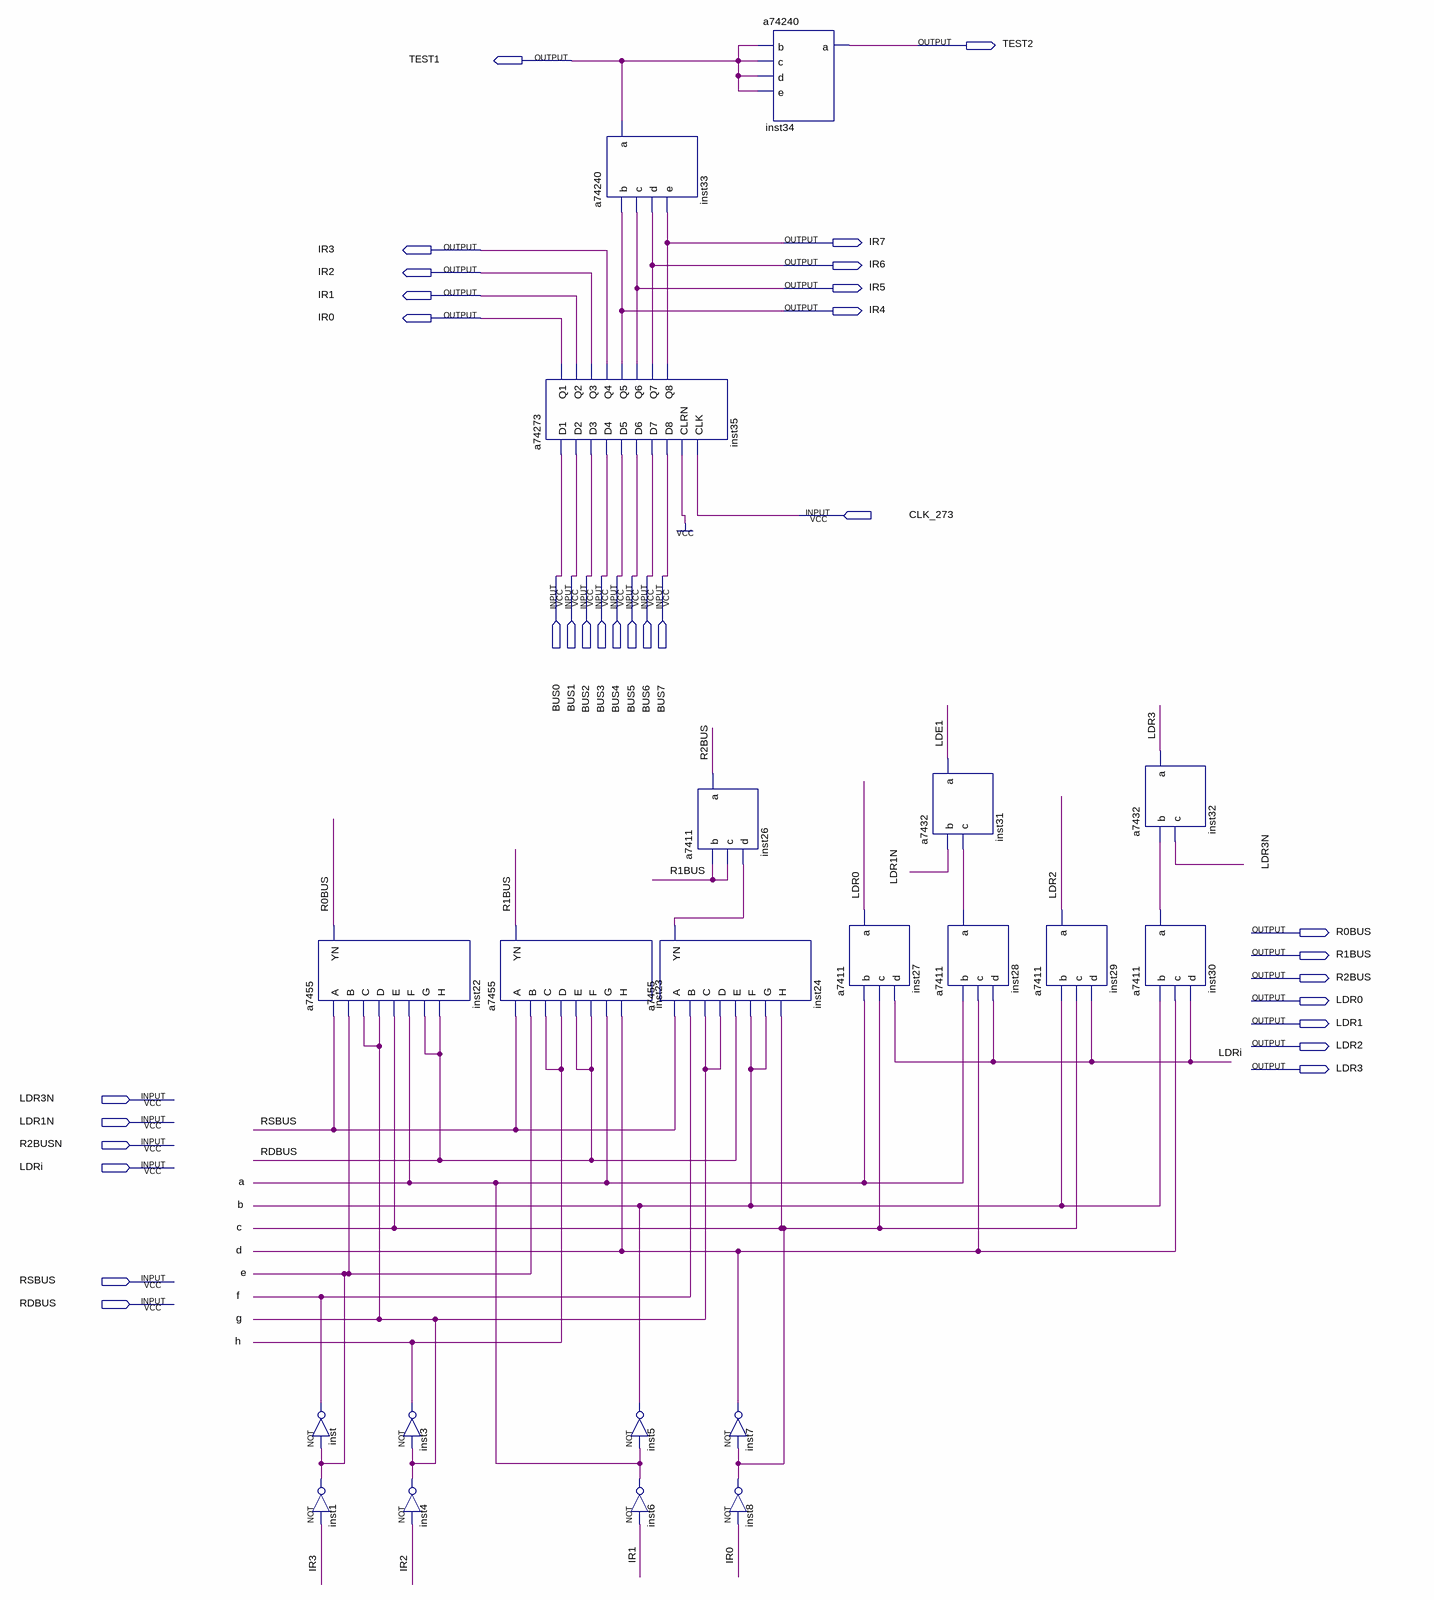
[diagram p0: schematic sheet]
// Quartus schematic EXEX.bdf as structural Verilog: 21 symbols, 32 pins
module EXEX (
  input  CLK_273,
  input  BUS0,
  input  BUS1,
  input  BUS2,
  input  BUS3,
  input  BUS4,
  input  BUS5,
  input  BUS6,
  input  BUS7,
  input  LDR3N,
  input  LDR1N,
  input  R2BUSN,
  input  LDRi,
  input  RSBUS,
  input  RDBUS,
  output TEST2,
  output TEST1,
  output IR7,
  output IR3,
  output IR6,
  output IR2,
  output IR5,
  output IR1,
  output IR4,
  output IR0,
  output R0BUS,
  output R1BUS,
  output R2BUS,
  output LDR0,
  output LDR1,
  output LDR2,
  output LDR3
);

  wire a, b, c, d, e, f, g, h, inst24_yn, inst28_a, inst30_a, LDE1;

  a7455 inst22 (.A(RSBUS), .B(e), .C(g), .D(g), .E(c), .F(a), .G(RDBUS), .H(RDBUS), .YN(R0BUS));
  not inst (f, e);
  not inst1 (e, IR3);
  not inst3 (h, g);
  not inst4 (g, IR2);
  a7455 inst23 (.A(RSBUS), .B(e), .C(h), .D(h), .E(RDBUS), .F(RDBUS), .G(a), .H(d), .YN(R1BUS));
  a74273 inst35 (
    .D1(BUS0), .D2(BUS1), .D3(BUS2), .D4(BUS3), .D5(BUS4), .D6(BUS5), .D7(BUS6), .D8(BUS7), .CLK(CLK_273),
    .CLRN(1'b1), .Q1(IR0), .Q2(IR1), .Q3(IR2), .Q4(IR3), .Q5(IR4), .Q6(IR5), .Q7(IR6), .Q8(IR7));
  a74240 inst33 (.b(IR4), .c(IR5), .d(IR6), .e(IR7), .a(TEST1));
  a7455 inst24 (.A(RSBUS), .B(f), .C(g), .D(g), .E(RDBUS), .F(b), .G(b), .H(c), .YN(inst24_yn));
  not inst5 (b, a);
  not inst6 (a, IR1);
  a7411 inst26 (.b(R1BUS), .c(R1BUS), .d(inst24_yn), .a(R2BUS));
  not inst7 (d, c);
  not inst8 (c, IR0);
  a74240 inst34 (.b(TEST1), .c(TEST1), .d(TEST1), .e(TEST1), .a(TEST2));
  a7411 inst27 (.b(a), .c(c), .d(LDRi), .a(LDR0));
  a7432 inst31 (.b(LDR1N), .c(inst28_a), .a(LDE1));
  a7411 inst28 (.b(a), .c(d), .d(LDRi), .a(inst28_a));
  a7411 inst29 (.b(b), .c(c), .d(LDRi), .a(LDR2));
  a7432 inst32 (.b(inst30_a), .c(LDR3N), .a(LDR3));
  a7411 inst30 (.b(b), .c(d), .d(LDRi), .a(inst30_a));
endmodule
